# Altium schematic sheet DB_LEDS.SchDoc: Daughter Board LEDs
size A4; DrawnBy: Brett Muir; SheetNumber: 13; SheetTotal: 19
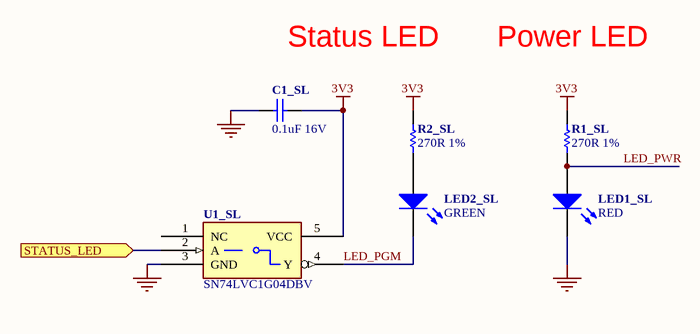
[diagram p0: DB_LEDS.SchDoc]

## Parts
C1_SL  0.1uF 16V  [CAPC1005-STAR]
LED1_SL  RED  [LED2012-STAR]
LED2_SL  GREEN  [LED2012-STAR]
R1_SL  270R 1%  [RESC1005-STAR]
R2_SL  270R 1%  [RESC1005-STAR]
U1_SL  SN74LVC1G04DBV  [SOT95P280-5]

## Ports
STATUS_LED (in)

## Nets
3V3: C1_SL.2 R1_SL.1 R2_SL.1 U1_SL.5(VCC)
GND: C1_SL.1 LED1_SL.2(K) U1_SL.3(GND)
LED_PGM: LED2_SL.2(K) U1_SL.4(Y)
LED_PWR: LED1_SL.1(A) R1_SL.2
STATUS_LED: U1_SL.2(A) ; port STATUS_LED
NetLED2_SL_1: LED2_SL.1(A) R2_SL.2

Not connected (* = marked no-connect by the designer): U1_SL 1(NC)

## Notes on the sheet
- Status LED
- Power LED
- Sheet Title
- Project Title
- Size:
- Date:
- A4
- Assy:
- Time:
- Sheet
- Revision:
- of
- File:

## Library data of the parts
C1_SL = D-101-0080: Capacitor, Ceramic, 0.1uF 10% 16V 0402 (1005) X7R; Polarity: Non-Polarized; Capacitance: 0.1 uF; Dielectric: X7R; Mounting Technology: Surface Mount; Rated Voltage: 16 V; Status: Production; Technology: Ceramic; Tolerance: 10 %; Category: Capacitor
LED1_SL = D-153-0003: LED, Red 0805 (2013) HSMH-C170; Brightness: 17.0 mcd; Peak Wave Length: 639 nm; Color: N/A; Mounting Technology: Surface Mount; Status: Production; Category: LED
LED2_SL = D-153-0004: LED, Green 0805 (2012) KP-2012SGD; Brightness: 12.5 mcd; Peak Wave Length: 565 nm; Color: N/A; Mounting Technology: Surface Mount; Status: Production; Category: LED
R1_SL R2_SL = D-100-0111: Resistor, 270R 1% 0402 (1005); Power Rating: 63 mW; Mounting Technology: Surface Mount; Resistance: 270 R; Status: Production; Tolerance: 1 %; Category: Resistor
U1_SL = D-205-0001: SN74LVC1G04DBV, Single Inverter Gate, 1.65-V to 5.5-V; Mounting Technology: Surface Mount; Status: Production; Category: IC-Logic